# Altium schematic sheet PCI short card universal - 32 BIT.schdoc: PCI short card universal - 32 BIT
size A; Organization: Organization; Address1: Address1; Address2: Address2; Address3: Address3; Address4: Address4; DocumentNumber: 1; Revision: 0; SheetNumber: 2; SheetTotal: 2
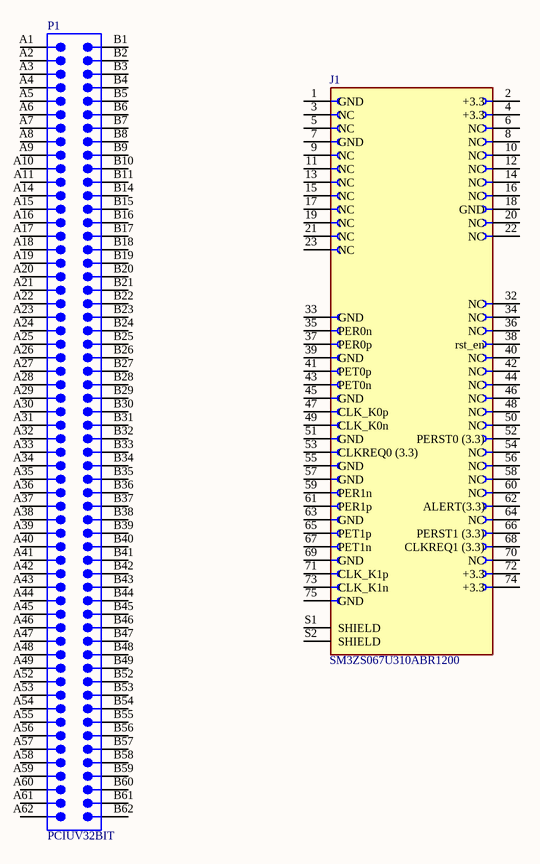
[diagram p0: PCI short card universal - 32 BIT.schdoc]

## Parts
J1  SM3ZS067U310ABR1200  [JAE_SM3ZS067U310ABR1200]
P1  PCIUV32BIT  [PCIUV32BIT]

## Nets

Not connected (* = marked no-connect by the designer): J1 1(GND) 2(+3.3) 3(NC) 4(+3.3) 5(NC) 6(NC) 7(GND) 8(NC) 9(NC) 10(NC) 11(NC) 12(NC) 13(NC) 14(NC) 15(NC) 16(NC) 17(NC) 18(GND) 19(NC) 20(NC) 21(NC) 22(NC) 23(NC) 32(NC) 33(GND) 34(NC) 35(PER0n) 36(NC) 37(PER0p) 38(rst_en) 39(GND) 40(NC) 41(PET0p) 42(NC) 43(PET0n) 44(NC) 45(GND) 46(NC) 47(CLK_K0p) 48(NC) 49(CLK_K0n) 50(NC) 51(GND) 52(PERST0_(3.3)) 53(CLKREQ0_(3.3)) 54(NC) 55(GND) 56(NC) 57(GND) 58(NC) 59(PER1n) 60(NC) 61(PER1p) 62(ALERT(3.3)) 63(GND) 64(NC) 65(PET1p) 66(PERST1_(3.3)) 67(PET1n) 68(CLKREQ1_(3.3)) 69(GND) 70(NC) 71(CLK_K1p) 72(+3.3) 73(CLK_K1n) 74(+3.3) 75(GND) S1(SHIELD) S2(SHIELD); P1 A1 A2 A3 A4 A5 A6 A7 A8 A9 A10 A11 A14 A15 A16 A17 A18 A19 A20 A21 A22 A23 A24 A25 A26 A27 A28 A29 A30 A31 A32 A33 A34 A35 A36 A37 A38 A39 A40 A41 A42 A43 A44 A45 A46 A47 A48 A49 A52 A53 A54 A55 A56 A57 A58 A59 A60 A61 A62 B1 B2 B3 B4 B5 B6 B7 B8 B9 B10 B11 B14 B15 B16 B17 B18 B19 B20 B21 B22 B23 B24 B25 B26 B27 B28 B29 B30 B31 B32 B33 B34 B35 B36 B37 B38 B39 B40 B41 B42 B43 B44 B45 B46 B47 B48 B49 B52 B53 B54 B55 B56 B57 B58 B59 B60 B61 B62

## Library data of the parts
J1 = SM3ZS067U310ABR1200: 67 Position Female Connector M.2 (NGFF) Mini Card Gold 0.020 (0.50mm); MF: JAE Electronics; Availability: Warning; MP: SM3ZS067U310ABR1200; SnapEDA_Link: https://www.snapeda.com/parts/SM3ZS067U310ABR1200/JAE%20Electronics/view-part/652226/?ref=snap; Purchase-URL: https://pricing.snapeda.com/search/part/SM3ZS067U310ABR1200/?ref=eda; Package: None; Check_prices: https://www.snapeda.com/parts/SM3ZS067U310ABR1200/JAE%20Electronics/view-part/652226/?ref=eda; Value: *; Price: None
P1 = PCIUV32BIT: Card, 116-Position; Text Field6: Pins A12, A13, B12, B13, A50, A51, B50 & B51 are not present.  Alternate Layout Available; Text Field7: Published 14-Feb-2002